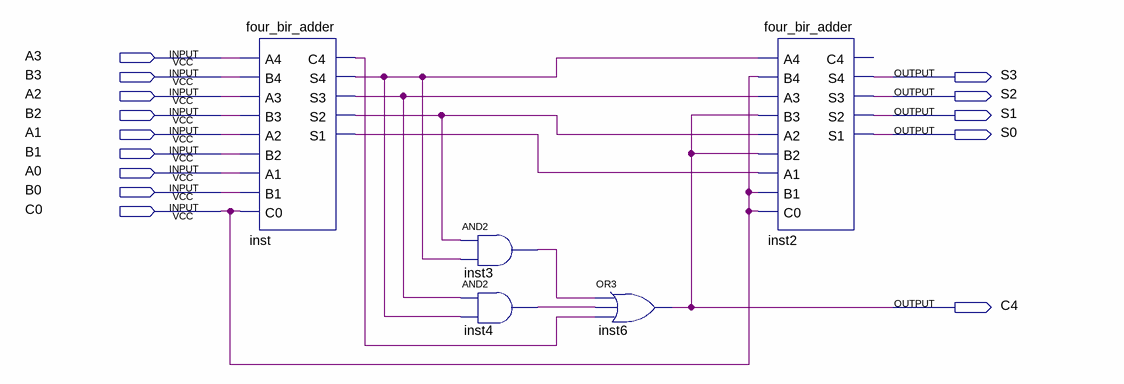
[diagram p0: schematic sheet]
// Quartus schematic BCD_adder_1D.bdf as structural Verilog: 5 symbols, 14 pins
module BCD_adder_1D (
  input  A3,
  input  B3,
  input  A2,
  input  B2,
  input  A1,
  input  B1,
  input  A0,
  input  B0,
  input  C0,
  output S3,
  output S2,
  output S1,
  output S0,
  output C4
);

  wire inst3_out, inst4_out, inst_c4, inst_s1, inst_s2, inst_s3, inst_s4;

  four_bir_adder inst (
    .A4(A3), .B4(B3), .A3(A2), .B3(B2), .A2(A1), .B2(B1), .A1(A0), .B1(B0), .C0(C0), .C4(inst_c4),
    .S4(inst_s4), .S3(inst_s3), .S2(inst_s2), .S1(inst_s1));
  and inst3 (inst3_out, inst_s2, inst_s4);
  and inst4 (inst4_out, inst_s3, inst_s4);
  or inst6 (C4, inst3_out, inst4_out, inst_c4);
  four_bir_adder inst2 (
    .A4(inst_s4), .B4(C0), .A3(inst_s3), .B3(C4), .A2(inst_s2), .B2(C4), .A1(inst_s1), .B1(C0), .C0(C0),
    .S4(S3), .S3(S2), .S2(S1), .S1(S0));  // open: C4
endmodule
